# Altium project QUTMS-AMU-V1.PrjPcb
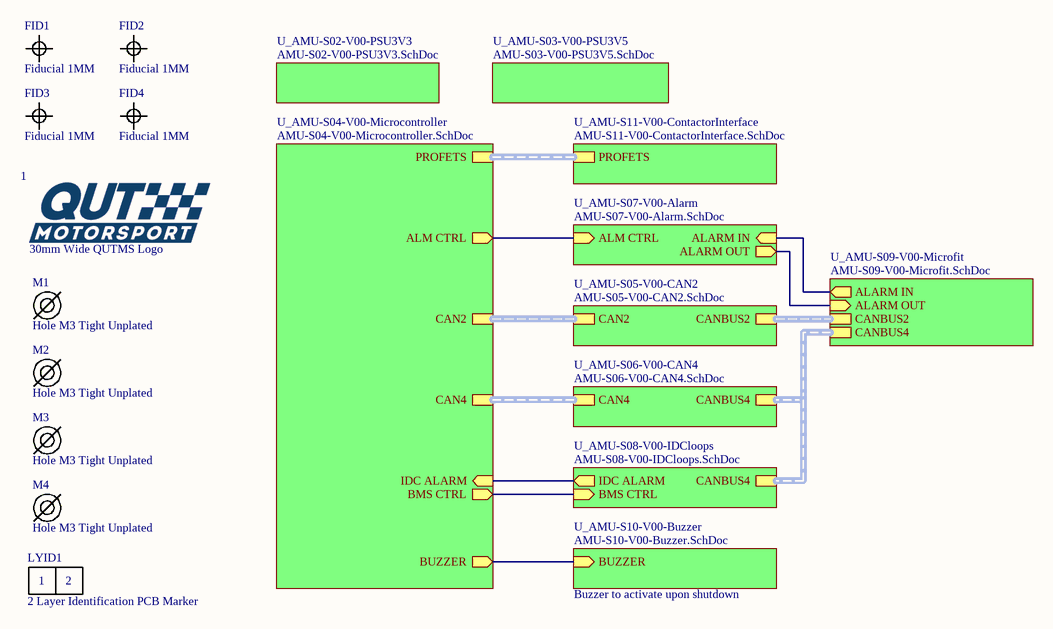
[diagram p0: AMU-S01-V00.SchDoc]
12 sheets, 174 parts. Net scope: hierarchical (ports join the sheet entries above them; power ports are global).
Board file: AMU-P01-V00.PcbDoc
Sheets:
  AMU-S01-V00.SchDoc
    U_AMU-S02-V00-PSU3V3 = AMU-S02-V00-PSU3V3.SchDoc
    U_AMU-S03-V00-PSU3V5 = AMU-S03-V00-PSU3V5.SchDoc
    U_AMU-S11-V00-ContactorInterface = AMU-S11-V00-ContactorInterface.SchDoc
      PROFET 3 = AMU-S12-V00-PROFET.SchDoc
      PROFET 2 = AMU-S12-V00-PROFET.SchDoc
      PROFET 1 = AMU-S12-V00-PROFET.SchDoc
    U_AMU-S04-V00-Microcontroller = AMU-S04-V00-Microcontroller.SchDoc
    U_AMU-S08-V00-IDCloops = AMU-S08-V00-IDCloops.SchDoc
    U_AMU-S07-V00-Alarm = AMU-S07-V00-Alarm.SchDoc
    U_AMU-S09-V00-Microfit = AMU-S09-V00-Microfit.SchDoc
    U_AMU-S10-V00-Buzzer = AMU-S10-V00-Buzzer.SchDoc
    U_AMU-S05-V00-CAN2 = AMU-S05-V00-CAN2.SchDoc
    U_AMU-S06-V00-CAN4 = AMU-S06-V00-CAN4.SchDoc

## Sheet AMU-S01-V00.SchDoc: AMU Master
size A3; DrawnBy: Thomas Benedetti; DocumentNumber: 1; SheetNumber: 1; SheetTotal: 12; Version: 00; Project: AMU 2020; PageSetup: Record=PageOptions|CenterHorizontal=True|CenterVertical=True|PrintScale=0.97|XCorrection=1.00|YCorrection=1.00|PrintKind=0|BorderSize=5000000|LeftOffset=0|BottomOffset=0|Orientation=2|PaperLength=1000|PaperWidth=1000|Scale=100|PaperSource=7|PrintQuality=-4|MediaType=1|DitherType=10|PaperKind=A4|PrintScaleMode=1

### Parts
1  30mm Wide QUTMS Logo  [QUTMS LOGO 30MM]
FID1  Fiducial 1MM  [FIDUCIAL 1MM]
FID2  Fiducial 1MM  [FIDUCIAL 1MM]
FID3  Fiducial 1MM  [FIDUCIAL 1MM]
FID4  Fiducial 1MM  [FIDUCIAL 1MM]
LYID1  2 Layer Identification PCB Marker  [LAYER IDENT 2]
M1  Hole M3 Tight Unplated  [M3.2 UNPLATED]
M2  Hole M3 Tight Unplated  [M3.2 UNPLATED]
M3  Hole M3 Tight Unplated  [M3.2 UNPLATED]
M4  Hole M3 Tight Unplated  [M3.2 UNPLATED]

### Sub-sheets
U_AMU-S02-V00-PSU3V3 = AMU-S02-V00-PSU3V3.SchDoc: no entries
U_AMU-S03-V00-PSU3V5 = AMU-S03-V00-PSU3V5.SchDoc: no entries
U_AMU-S04-V00-Microcontroller = AMU-S04-V00-Microcontroller.SchDoc: PROFETS, ALM CTRL (out), BMS CTRL (out), BUZZER (out), CAN2, CAN4, IDC ALARM (in)
U_AMU-S05-V00-CAN2 = AMU-S05-V00-CAN2.SchDoc: CANBUS2 (harness CANBUS2), CAN2 (harness CAN2)
U_AMU-S06-V00-CAN4 = AMU-S06-V00-CAN4.SchDoc: CANBUS4 (harness CANBUS4), CAN4 (harness CAN4)
U_AMU-S07-V00-Alarm = AMU-S07-V00-Alarm.SchDoc: ALARM IN (in), ALARM OUT (out), ALM CTRL (in)
U_AMU-S08-V00-IDCloops = AMU-S08-V00-IDCloops.SchDoc: BMS CTRL (in), CANBUS4 (harness CANBUS4), IDC ALARM (out)
U_AMU-S09-V00-Microfit = AMU-S09-V00-Microfit.SchDoc: CANBUS2 (harness CANBUS2), CANBUS4 (harness CANBUS4), ALARM OUT (in), ALARM IN (out)
U_AMU-S10-V00-Buzzer = AMU-S10-V00-Buzzer.SchDoc: BUZZER (in)
U_AMU-S11-V00-ContactorInterface = AMU-S11-V00-ContactorInterface.SchDoc: PROFETS (harness PROFETS)

### Nets
ALARM IN: sheet U_AMU-S07-V00-Alarm/ALARM IN, sheet U_AMU-S09-V00-Microfit/ALARM IN
ALARM OUT: sheet U_AMU-S07-V00-Alarm/ALARM OUT, sheet U_AMU-S09-V00-Microfit/ALARM OUT
ALM CTRL: sheet U_AMU-S04-V00-Microcontroller/ALM CTRL, sheet U_AMU-S07-V00-Alarm/ALM CTRL
BMS CTRL: sheet U_AMU-S04-V00-Microcontroller/BMS CTRL, sheet U_AMU-S08-V00-IDCloops/BMS CTRL
BUZZER: sheet U_AMU-S04-V00-Microcontroller/BUZZER, sheet U_AMU-S10-V00-Buzzer/BUZZER
IDC ALARM: sheet U_AMU-S04-V00-Microcontroller/IDC ALARM, sheet U_AMU-S08-V00-IDCloops/IDC ALARM

### Buses and harness runs
harness sheet U_AMU-S04-V00-Microcontroller/CAN2 = sheet U_AMU-S05-V00-CAN2/CAN2
harness sheet U_AMU-S04-V00-Microcontroller/CAN4 = sheet U_AMU-S06-V00-CAN4/CAN4
harness sheet U_AMU-S04-V00-Microcontroller/PROFETS = sheet U_AMU-S11-V00-ContactorInterface/PROFETS
harness sheet U_AMU-S05-V00-CAN2/CANBUS2 = sheet U_AMU-S09-V00-Microfit/CANBUS2
harness sheet U_AMU-S06-V00-CAN4/CANBUS4 = sheet U_AMU-S08-V00-IDCloops/CANBUS4 = sheet U_AMU-S09-V00-Microfit/CANBUS4

### Notes on the sheet
- Buzzer to activate upon shutdown
- Revision History:
- Sheet Title:
- Rev
- Date
- Description
- Project:
- Size:
- Drawn By:
- A3
- Number:
- Revision:
- Sheet
- Version:
- of
- QUT Motorsport
- O-120, Gardens Point
- 2 George Street
- Brisbane, QLD 4000
- Australia
- Print Date:
- Print Time:
- File Name:
- (in symbol Layer Identification 2) 1; 2

### Library data of the parts
1 = QUTMS Logo 30mm
LYID1 = Layer Identification 2
M1-M4 = Hole M3 Tight Unplated: M3.2 Hole, No Plating

## Sheet AMU-S02-V00-PSU3V3.SchDoc: Power Supply (20-40V to 3v3 @ 0.1-0.6A)
size A3; DrawnBy: Jonn Dillon; DocumentNumber: 2; Revision: 01; SheetNumber: 2; SheetTotal: 12; Version: 01; Project: AMU 2020 (Sourced from BMS 2020); PageSetup: Record=PageOptions|CenterHorizontal=True|CenterVertical=True|PrintScale=0.97|XCorrection=1.00|YCorrection=1.00|PrintKind=0|BorderSize=5000000|LeftOffset=0|BottomOffset=0|Orientation=2|PaperLength=1000|PaperWidth=1000|Scale=100|PaperSource=7|PrintQuality=-4|MediaType=1|DitherType=10|PaperKind=A4|PrintScaleMode=1
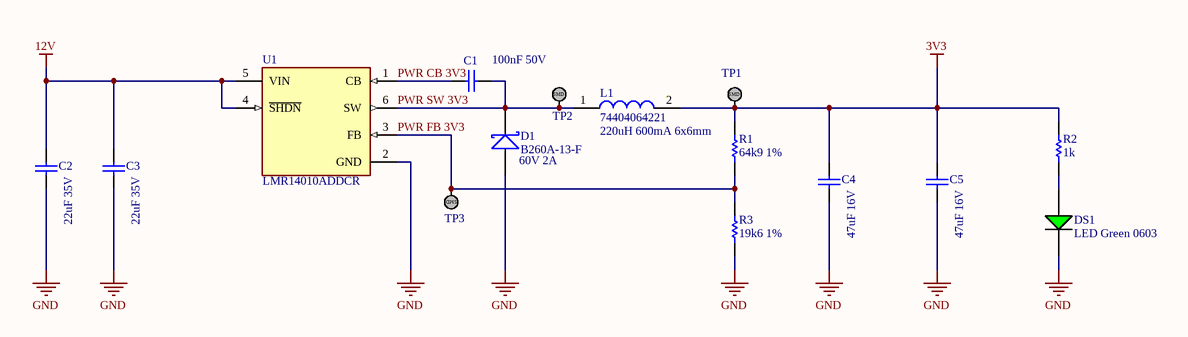
[diagram p1: AMU-S02-V00-PSU3V3.SchDoc]

### Parts
C1  100nF 50V  [Cap_Ceramic_0603]
C2  22uF 35V  [Cap_Ceramic_1206]
C3  22uF 35V  [Cap_Ceramic_1206]
C4  47uF 16V  [Cap_Ceramic_0603]
C5  47uF 16V  [Cap_Ceramic_0603]
D1  B260A-13-F  [SMA]
DS1  LED Green 0603  [LED GREEN 0603]
L1  74404064221  [Inductor_6x6mm]
R1  64k9 1%  [Res_ThinFilm_0603]
R2  1k  [Res_ThinFilm_0603]
R3  19k6 1%  [Res_ThinFilm_0603]
TP1  TestPoint_SMD  [TestPointSMD]  (value not drawn)
TP2  TestPoint_SMD  [TestPointSMD]  (value not drawn)
TP3  TestPoint_SMD  [TestPointSMD]  (value not drawn)
U1  LMR14010ADDCR  [FP-DDC0006A-MFG]

### Nets
3V3: C4.2 C5.2 L1.2 R1.2 R2.2 TP1.1
12V: C2.2 C3.2 U1.4(~{SHDN}) U1.5(VIN)
GND: C2.1 C3.1 C4.1 C5.1 D1.A DS1.2(C) R3.1 U1.2(GND)
PWR CB 3V3: C1.1 U1.1(CB)
PWR FB 3V3: R1.1 R3.2 TP3.1 U1.3(FB)
PWR SW 3V3: C1.2 D1.K L1.1 TP2.1 U1.6(SW)
NetDS1_1: DS1.1(A) R2.1

### Notes on the sheet
- (near D1) 60V 2A
- (near L1) 220uH 600mA 6x6mm
- Revision History:
- Sheet Title:
- Rev
- Date
- Description
- Project:
- Size:
- Drawn By:
- A3
- Number:
- Revision:
- Sheet
- Version:
- of
- QUT Motorsport
- O-120, Gardens Point
- 2 George Street
- Brisbane, QLD 4000
- Australia
- Print Date:
- Print Time:
- File Name:
- (in symbol TestPoint_SMD) SMD

### Library data of the parts
C1 = 100nF 50V 5% X7R 0603: Capacitor, Ceramic, SMD, 100nF, 50V, 5%, X7R, 0603
C2 C3 = 22uF 35V 20% X5R 1206: 22µF ±20% 35V Ceramic Capacitor X5R 1206 (3216 Metric); ComponentLink1Description: Digikey; ComponentLink1URL: https://www.digikey.com.au/product-detail/en/tdk-corporation/C3216X5R1V226M160AC/445-8045-1-ND/2792165; ComponentLink2Description: Datasheet; ComponentLink2URL: https://product.tdk.com/info/en/catalog/datasheets/mlcc_commercial_general_en.pdf
C4 C5 = 47uF 16V 10% X7R 1210: Capacitor, Ceramic, SMD, 47uF, 16V, 5%, X7R, 1210
D1 = B260A-13-F: Diode, Schottky Barrier Rectifier, 60 V, 2 A, B260A-13-F
L1 = 74404064221: FIXED IND 220UH 660MA 850 MOHM; ComponentLink1Description: Digikey; ComponentLink1URL: https://www.digikey.com.au/product-detail/en/w%C3%BCrth-elektronik/74404064221/732-7261-1-ND/5353241; ComponentLink2Description: LCSC A; ComponentLink2URL: https://lcsc.com/product-detail/Power-Inductors_Sunlord-SWPA6045S221MT_C91047.html; ComponentLink3Description: LCSC B; ComponentLink3URL: https://lcsc.com/product-detail/Power-Inductors_SXN-Shun-Xiang-Nuo-Elec-SMNR6045-221MT_C467145.html
R1 = 64k9 1% 0603: Resistor, SMD, 64k9, 0.1W, 5%, 0603
R2 = 1k 5% 0603: Resistor, SMD, 1k, 0.1W, 5%, 0603
R3 = 19k6 1% 0603: Resistor, SMD, 19k6, 0.1W, 5%, 0603
U1 = CMP-04918-000056-1: IC REG BUCK ADJ 1A TSOT23-6; Manufacturer: Texas Instruments; Max Junction Temp: +125°C; Number Of Outputs: 1; Standoff Height: 0mm; Switching Frequency: 700kHz; Min Supply Voltage: 4V; Max Supply Voltage: 40V; Max Duty Cycle: 96%; Output Type: AdjustableProgrammable; Manufacturer Part Number: LMR14010ADDCR; Temperature: -40°C to +125°C; Output Current: 1A; Category: IC; Temperature Range High: +125°C; Lead Free: Yes; Switching Topology: Buck; Mouser Description: 4-V to 40-V, 1-A Step-Down Converter With High Efficiency Eco-Mode 6-SOT-23-THIN -40 to 125; Device Class L1: Integrated Circuits (ICs); Digikey Description: IC REG BUCK ADJ 1A TSOT23-6; Package: DDC0006A; Ipc Land Pattern Name: SOT95P280X110-6; Device Class L2: Power Management ICs; Temperature Range Low: -40°C; Height: 1.1mm; Device Class L3: Voltage Regulators - Switching; RoHS: TRUE; Automotive: No; Octopart: https://octopart.com/lmr14010addcr-texas+instruments-90753290; ComponentLink2URL: https://www.ti.com/lit/ds/symlink/lmr14010a.pdf; ComponentLink2Description: Datasheet

## Sheet AMU-S03-V00-PSU3V5.SchDoc: Power Supply (20-40V to 3v3 @ 0.1-0.6A)
size A3; DrawnBy: Jonn Dillon; DocumentNumber: 3; SheetNumber: 3; SheetTotal: 12; Version: 00; Project: AMU 2020 (Sourced from BMS 2020); PageSetup: Record=PageOptions|CenterHorizontal=True|CenterVertical=True|PrintScale=0.97|XCorrection=1.00|YCorrection=1.00|PrintKind=0|BorderSize=5000000|LeftOffset=0|BottomOffset=0|Orientation=2|PaperLength=1000|PaperWidth=1000|Scale=100|PaperSource=7|PrintQuality=-4|MediaType=1|DitherType=10|PaperKind=A4|PrintScaleMode=1
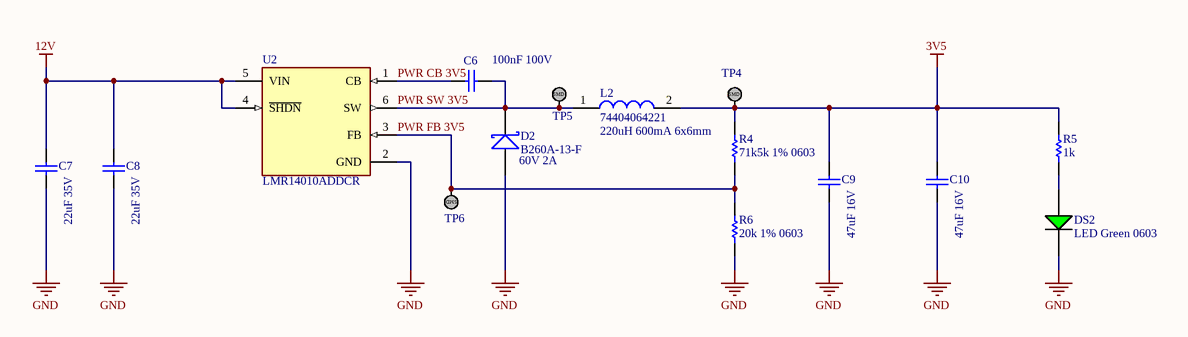
[diagram p2: AMU-S03-V00-PSU3V5.SchDoc]

### Parts
C6  100nF 100V  [Cap_Ceramic_0603]
C7  22uF 35V  [Cap_Ceramic_1206]
C8  22uF 35V  [Cap_Ceramic_1206]
C9  47uF 16V  [Cap_Ceramic_0603]
C10  47uF 16V  [Cap_Ceramic_0603]
D2  B260A-13-F  [SMA]
DS2  LED Green 0603  [LED GREEN 0603]
L2  74404064221  [Inductor_6x6mm]
R4  71k5k 1% 0603  [Res_ThinFilm_0603]
R5  1k  [Res_ThinFilm_0603]
R6  20k 1% 0603  [Res_ThinFilm_0603]
TP4  TestPoint_SMD  [TestPointSMD]  (value not drawn)
TP5  TestPoint_SMD  [TestPointSMD]  (value not drawn)
TP6  TestPoint_SMD  [TestPointSMD]  (value not drawn)
U2  LMR14010ADDCR  [FP-DDC0006A-MFG]

### Nets
3V5: C9.2 C10.2 L2.2 R4.2 R5.2 TP4.1
12V: C7.2 C8.2 U2.4(~{SHDN}) U2.5(VIN)
GND: C7.1 C8.1 C9.1 C10.1 D2.A DS2.2(C) R6.1 U2.2(GND)
PWR CB 3V5: C6.1 U2.1(CB)
PWR FB 3V5: R4.1 R6.2 TP6.1 U2.3(FB)
PWR SW 3V5: C6.2 D2.K L2.1 TP5.1 U2.6(SW)
NetDS2_1: DS2.1(A) R5.1

### Notes on the sheet
- (near D2) 60V 2A
- (near L2) 220uH 600mA 6x6mm
- Revision History:
- Sheet Title:
- Rev
- Date
- Description
- Project:
- Size:
- Drawn By:
- A3
- Number:
- Revision:
- Sheet
- Version:
- of
- QUT Motorsport
- O-120, Gardens Point
- 2 George Street
- Brisbane, QLD 4000
- Australia
- Print Date:
- Print Time:
- File Name:
- (in symbol TestPoint_SMD) SMD

### Library data of the parts
C6 = 100nF 100V 5% X7R 0603: Capacitor, Ceramic, SMD, 100nF, 100V, 5%, X7R, 0603
C7 C8 = 22uF 35V 20% X5R 1206: as C2 on sheet AMU-S02-V00-PSU3V3; ComponentLink1Description: Digikey; ComponentLink1URL: https://www.digikey.com.au/product-detail/en/tdk-corporation/C3216X5R1V226M160AC/445-8045-1-ND/2792165; ComponentLink2Description: Datasheet; ComponentLink2URL: https://product.tdk.com/info/en/catalog/datasheets/mlcc_commercial_general_en.pdf
C9 C10 = 47uF 16V 10% X7R 1210: as C4 on sheet AMU-S02-V00-PSU3V3
D2 = B260A-13-F: as D1 on sheet AMU-S02-V00-PSU3V3
L2 = 74404064221: FIXED IND 220UH 660MA 850 MOHM; ComponentLink1Description: Digikey; ComponentLink1URL: https://www.digikey.com.au/product-detail/en/w%C3%BCrth-elektronik/74404064221/732-7261-1-ND/5353241; ComponentLink2Description: LCSC A; ComponentLink2URL: https://lcsc.com/product-detail/Power-Inductors_Sunlord-SWPA6045S221MT_C91047.html; ComponentLink3Description: LCSC B; ComponentLink3URL: https://lcsc.com/product-detail/Power-Inductors_SXN-Shun-Xiang-Nuo-Elec-SMNR6045-221MT_C467145.html
R4 = 71k5 1% 0603: Resistor, SMD, 71k5, 0.1W, 1%, 0603
R5 = 1k 5% 0603: Resistor, SMD, 1k, 0.1W, 5%, 0603
R6 = 20k 1% 0603: Resistor, SMD, 20k, 0.1W, 1%, 0603
U2 = CMP-04918-000056-1: as U1 on sheet AMU-S02-V00-PSU3V3; Manufacturer Part Number: LMR14010ADDCR; Temperature: -40°C to +125°C; Output Current: 1A; Category: IC; Temperature Range High: +125°C; Lead Free: Yes; Switching Topology: Buck; Mouser Description: 4-V to 40-V, 1-A Step-Down Converter With High Efficiency Eco-Mode 6-SOT-23-THIN -40 to 125; Device Class L1: Integrated Circuits (ICs); Digikey Description: IC REG BUCK ADJ 1A TSOT23-6; Package: DDC0006A; Ipc Land Pattern Name: SOT95P280X110-6; Device Class L2: Power Management ICs; Temperature Range Low: -40°C; Height: 1.1mm; Device Class L3: Voltage Regulators - Switching; RoHS: TRUE; Automotive: No; Octopart: https://octopart.com/lmr14010addcr-texas+instruments-90753290; ComponentLink2URL: https://www.ti.com/lit/ds/symlink/lmr14010a.pdf; ComponentLink2Description: Datasheet

## Sheet AMU-S11-V00-ContactorInterface.SchDoc: Contactor Interface
size A3; DrawnBy: Thomas Benedetti; DocumentNumber: 11; SheetNumber: 11; SheetTotal: 12; Version: 00; Project: AMU 2020; PageSetup: Record=PageOptions|CenterHorizontal=True|CenterVertical=True|PrintScale=0.97|XCorrection=1.00|YCorrection=1.00|PrintKind=0|BorderSize=5000000|LeftOffset=0|BottomOffset=0|Orientation=2|PaperLength=1000|PaperWidth=1000|Scale=100|PaperSource=7|PrintQuality=-4|MediaType=1|DitherType=10|PaperKind=A4|PrintScaleMode=1
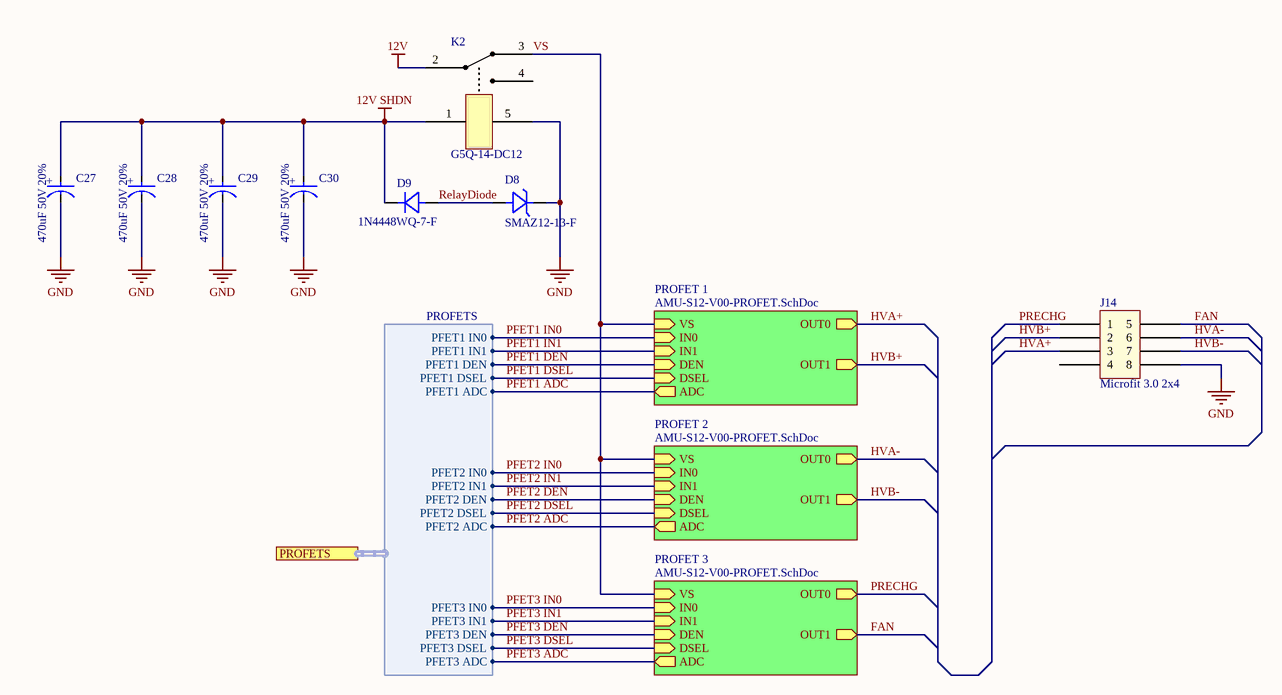
[diagram p3: AMU-S11-V00-ContactorInterface.SchDoc]

### Parts
C27  470uF 50V 20%  [CAP_ALU_TH]
C28  470uF 50V 20%  [CAP_ALU_TH]
C29  470uF 50V 20%  [CAP_ALU_TH]
C30  470uF 50V 20%  [CAP_ALU_TH]
D8  SMAZ12-13-F  [SMA]
D9  1N4448WQ-7-F  [SMA]
J14  Microfit 3.0 2x4  [Microfit_2X4_R_TH]
K2  G5Q-14-DC12  [G5Q-14]

### Sub-sheets
PROFET 1 = AMU-S12-V00-PROFET.SchDoc: VS (in), ADC (out), OUT0 (out), OUT1 (out), DSEL (in), DEN (in), IN1 (in), IN0 (in)
PROFET 2 = AMU-S12-V00-PROFET.SchDoc: VS (in), ADC (out), OUT0 (out), OUT1 (out), DSEL (in), DEN (in), IN1 (in), IN0 (in)
PROFET 3 = AMU-S12-V00-PROFET.SchDoc: VS (in), ADC (out), OUT0 (out), OUT1 (out), DSEL (in), DEN (in), IN1 (in), IN0 (in)

### Ports
PROFETS (harness PROFETS)

### Harnesses
PROFETS: PFET1 IN0, PFET1 IN1, PFET1 DEN, PFET1 DSEL, PFET1 ADC, PFET2 IN0, PFET2 IN1, PFET2 DEN, PFET2 DSEL, PFET2 ADC, PFET3 IN0, PFET3 DSEL, PFET3 ADC, PFET3 DEN, PFET3 IN1

### Nets
12V: K2.2
12V SHDN: C27.A C28.A C29.A C30.A D9.K(Cathode) K2.1
GND: C27.K C28.K C29.K C30.K D8.K(Cathode) J14.8 K2.5
FAN: J14.5 ; sheet PROFET 3/OUT1
HVA+: J14.3 ; sheet PROFET 1/OUT0
HVA-: J14.6 ; sheet PROFET 2/OUT0
HVB+: J14.2 ; sheet PROFET 1/OUT1
HVB-: J14.7 ; sheet PROFET 2/OUT1
PFET1 ADC: sheet PROFET 1/ADC, port PROFETS.PFET1 ADC
PFET1 DEN: sheet PROFET 1/DEN, port PROFETS.PFET1 DEN
PFET1 DSEL: sheet PROFET 1/DSEL, port PROFETS.PFET1 DSEL
PFET1 IN0: sheet PROFET 1/IN0, port PROFETS.PFET1 IN0
PFET1 IN1: sheet PROFET 1/IN1, port PROFETS.PFET1 IN1
PFET2 ADC: sheet PROFET 2/ADC, port PROFETS.PFET2 ADC
PFET2 DEN: sheet PROFET 2/DEN, port PROFETS.PFET2 DEN
PFET2 DSEL: sheet PROFET 2/DSEL, port PROFETS.PFET2 DSEL
PFET2 IN0: sheet PROFET 2/IN0, port PROFETS.PFET2 IN0
PFET2 IN1: sheet PROFET 2/IN1, port PROFETS.PFET2 IN1
PFET3 ADC: sheet PROFET 3/ADC, port PROFETS.PFET3 ADC
PFET3 DEN: sheet PROFET 3/DEN, port PROFETS.PFET3 DEN
PFET3 DSEL: sheet PROFET 3/DSEL, port PROFETS.PFET3 DSEL
PFET3 IN0: sheet PROFET 3/IN0, port PROFETS.PFET3 IN0
PFET3 IN1: sheet PROFET 3/IN1, port PROFETS.PFET3 IN1
PRECHG: J14.1 ; sheet PROFET 3/OUT0  [project net OUT0]
RelayDiode: D8.A(Anode) D9.A(Anode)
VS: K2.3 ; sheet PROFET 3/VS, sheet PROFET 2/VS, sheet PROFET 1/VS

Not connected (* = marked no-connect by the designer): J14 4; K2 4

### Notes on the sheet
- Revision History:
- Sheet Title:
- Rev
- Date
- Description
- Project:
- Size:
- Drawn By:
- A3
- Number:
- Revision:
- Sheet
- Version:
- of
- QUT Motorsport
- O-120, Gardens Point
- 2 George Street
- Brisbane, QLD 4000
- Australia
- Print Date:
- Print Time:
- File Name:
- (in symbol 470uF 50V 20% Alum E-CAP) +

### Library data of the parts
C27-C30 = 470uF 50V 20% Alum E-CAP: 470µF 50V Aluminum Electrolytic Capacitors Radial, Can  5000 Hrs @ 105°C
D8 = SMAZ12-13-F: Zener Diode 12V 1W ±5% Surface Mount SMA; Manufacturer: ON Semiconductor; MPN: MM3Z56VB; ComponentLink1Description: Digikey; ComponentLink1URL: https://www.digikey.com.au/product-detail/en/diodes-incorporated/SMAZ12-13-F/SMAZ12-FDICT-ND/725073; ComponentLink2Description: Datasheet; ComponentLink2URL: https://www.diodes.com/assets/Datasheets/ds18015.pdf
D9 = 1N4448WQ-7-F: Diode, SMD, 75V, 5%, 250mA, SOD123; Manufacturer: ON Semiconductor / Fairchild; Manufacturer Part Number: 1N914BWS; Average Rectified Current: 150mA; Element Configuration: Single; Forward Voltage: 1V; Max Reverse Leakage Current: 5uA; Power Dissipation: 200mW; Recovery Time: 4ns; Max Forward Surge Current (Ifsm): 4A; Parameter 1: *; Weight: 0.0276g; Category: Rectifier Diodes; Contact Plating: Tin,Matte; Forward Current: 150mA; Lead Free: Lead Free; Max Operating Temperature: 150°C; Max Repetitive Reverse Voltage (Vrrm): 75V; Max Reverse Voltage (DC): 75V; Min Operating Temperature: -55°C; Mount: Surface Mount; Number of Pins: 2; Package Quantity: 1; Packaging: Tape and Reel; Peak Reverse Current: 5uA; Radiation Hardening: No; REACH SVHC: No SVHC; Reverse Recovery Time: 4ns; Height: 1mm; Length: 1.8mm; Reverse Voltage: 75V; Width: 1.35mm
J14 = Microfit_2x4
K2 = G5Q-14-DC12: General Purpose Relay SPDT (1 Form C) 12VDC Coil Through Hole, 12V, 16A

## Sheet AMU-S12-V00-PROFET.SchDoc
size A3; DocumentNumber: 12; SheetNumber: 12; SheetTotal: 12; Version: 00; Project: ####; PageSetup: Record=PageOptions|CenterHorizontal=True|CenterVertical=True|PrintScale=0.97|XCorrection=1.00|YCorrection=1.00|PrintKind=0|BorderSize=5000000|LeftOffset=0|BottomOffset=0|Orientation=2|PaperLength=1000|PaperWidth=1000|Scale=100|PaperSource=7|PrintQuality=-4|MediaType=1|DitherType=10|PaperKind=A4|PrintScaleMode=1
Used 3 times, as channels U_AMU-S11-V00-ContactorInterface/PROFET 3, U_AMU-S11-V00-ContactorInterface/PROFET 2, U_AMU-S11-V00-ContactorInterface/PROFET 1. Parts and nets are listed once, with the designators drawn on the sheet.
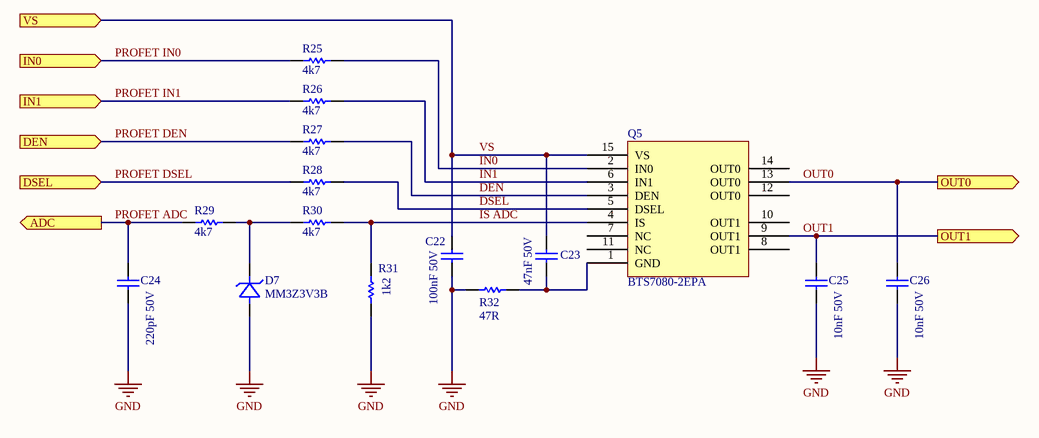
[diagram p4: AMU-S12-V00-PROFET.SchDoc]

### Parts
C22  100nF 50V  [Cap_Ceramic_0603]
C23  47nF 50V  [Cap_Ceramic_0603]
C24  220pF 50V  [Cap_Ceramic_0603]
C25  10nF 50V  [Cap_Ceramic_0603]
C26  10nF 50V  [Cap_Ceramic_0603]
D7  MM3Z3V3B  [SOD-323F]
Q5  BTS7080-2EPA  [BTS7008-2EPZ]
R25  4k7  [Res_ThinFilm_0603]
R26  4k7  [Res_ThinFilm_0603]
R27  4k7  [Res_ThinFilm_0603]
R28  4k7  [Res_ThinFilm_0603]
R29  4k7  [Res_ThinFilm_0603]
R30  4k7  [Res_ThinFilm_0603]
R31  1k2  [Res_ThinFilm_0603]
R32  47R  [Res_ThinFilm_0603]

### Ports
ADC (out), DEN (in), DSEL (in), IN0 (in), IN1 (in), OUT0 (out), OUT1 (out), VS (in)

### Nets
GND: C22.1 C24.1 C25.2 C26.2 D7.1(Anode) R31.1 R32.1
DEN: Q5.3(DEN) R27.2
DSEL: Q5.5(DSEL) R28.2
IN0: Q5.2(IN0) R25.2
IN1: Q5.6(IN1) R26.2
IS ADC: Q5.4(IS) R30.2 R31.2
OUT0: C26.1 Q5.13(OUT0) ; port OUT0
OUT1: C25.1 Q5.9(OUT1) ; port OUT1
PROFET ADC: C24.2 R29.1 ; port ADC
PROFET DEN: R27.1 ; port DEN
PROFET DSEL: R28.1 ; port DSEL
PROFET IN0: R25.1 ; port IN0
PROFET IN1: R26.1 ; port IN1
VS: C22.2 C23.2 Q5.15(VS) ; port VS
NetC23_1: C23.1 Q5.1(GND) R32.2
NetD7_2: D7.2(Cathode) R29.2 R30.1

Not connected (* = marked no-connect by the designer): Q5 7(NC) 8(OUT1) 10(OUT1) 11(NC) 12(OUT0) 14(OUT0)

### Channels
U_AMU-S11-V00-ContactorInterface/PROFET 3: designators end in A; ports ADC=PFET3 ADC DEN=PFET3 DEN DSEL=PFET3 DSEL IN0=PFET3 IN0 IN1=PFET3 IN1 OUT0=OUT0 OUT1=FAN VS=VS
U_AMU-S11-V00-ContactorInterface/PROFET 2: designators end in B; ports ADC=PFET2 ADC DEN=PFET2 DEN DSEL=PFET2 DSEL IN0=PFET2 IN0 IN1=PFET2 IN1 OUT0=HVA- OUT1=HVB- VS=VS
U_AMU-S11-V00-ContactorInterface/PROFET 1: designators end in C; ports ADC=PFET1 ADC DEN=PFET1 DEN DSEL=PFET1 DSEL IN0=PFET1 IN0 IN1=PFET1 IN1 OUT0=HVA+ OUT1=HVB+ VS=VS

### Notes on the sheet
- Revision History:
- Sheet Title:
- Rev
- Date
- Description
- Project:
- Size:
- Drawn By:
- A3
- Number:
- Revision:
- Sheet
- Version:
- of
- QUT Motorsport
- O-120, Gardens Point
- 2 George Street
- Brisbane, QLD 4000
- Australia
- Print Date:
- Print Time:
- File Name:

### Library data of the parts
C22 = 100nF 50V 5% X7R 0603: as C1 on sheet AMU-S02-V00-PSU3V3
C23 = 47nF 50V 10% X7R 0603: 0.047µF ±10% 50V Ceramic Capacitor X7R 0603 (1608 Metric); ComponentLink1Description: Digikey; ComponentLink1URL: https://www.digikey.com.au/product-detail/en/kemet/C0603C473K5RACTU/399-7933-1-ND/3471656; ComponentLink2Description: Datasheet; ComponentLink2URL: https://content.kemet.com/datasheets/KEM_C1002_X7R_SMD.pdf
C24 = 220pF 50V 5% 0603: 220pF ±5% 50V Ceramic Capacitor C0G, NP0 0603 (1608 Metric); ComponentLink1Description: Digikey; ComponentLink1URL: https://www.digikey.com.au/product-detail/en/kemet/C0603C221J5GACTU/399-1066-1-ND/411341; ComponentLink2Description: Datasheet; ComponentLink2URL: https://content.kemet.com/datasheets/KEM_C1003_C0G_SMD.pdf
C25 C26 = 10nF 50V 20% X7R 0603: 10000pF ±20% 50V Ceramic Capacitor X7R 0603 (1608 Metric); ComponentLink1Description: Digikey; ComponentLink1URL: https://www.digikey.com.au/product-detail/en/kemet/C0603C103M5RACTU/399-7842-1-ND/3471565; ComponentLink2Description: Datasheet; ComponentLink2URL: https://content.kemet.com/datasheets/KEM_C1002_X7R_SMD.pdf
D7 = MM3Z3V3B: Zener Diode 3.3V 200mW ±2% Surface Mount SOD-323F; Manufacturer: ON Semiconductor; MPN: MM3Z56VB; ComponentLink1Description: Digikey; ComponentLink1URL: https://www.digikey.com.au/product-detail/en/on-semiconductor/MM3Z3V3B/MM3Z3V3BCT-ND/1626881; ComponentLink2Description: Datasheet; ComponentLink2URL: https://www.onsemi.com/pub/Collateral/MM3Z9V1B-D.pdf
R25-R30 = 4k7 5% 0603: Resistor, SMD, 4k7, 0.1W, 5%, 0603
R31 = 1k2 5% 0603: Resistor, SMD, 1k2, 0.1W, 5%, 0603
R32 = 47R 5% 0603: Resistor, SMD, 47R, 0.1W, 5%, 0603
Q5 = BTS7080-2EPA: ComponentLink1Description: Infineon; ComponentLink1URL: https://www.infineon.com/cms/en/product/power/smart-low-side-high-side-switches/high-side-switches/profet-plus-2-12v-automotive-smart-high-side-switch/bts7080-2epa/; ComponentLink2Description: Datasheet; ComponentLink2URL: https://www.infineon.com/dgdl/Infineon-BTS7080-2EPA-DataSheet-v01_06-EN.pdf?fileId=5546d4625e763904015e941bf21e2dbe

## Sheet AMU-S04-V00-Microcontroller.SchDoc: AMU Microcontroller
size A3; DrawnBy: Thomas Benedetti; DocumentNumber: 4; Revision: 01; SheetNumber: 4; SheetTotal: 12; Version: 01; Project: AMU 2020; PageSetup: Record=PageOptions|CenterHorizontal=True|CenterVertical=True|PrintScale=0.97|XCorrection=1.00|YCorrection=1.00|PrintKind=0|BorderSize=5000000|LeftOffset=0|BottomOffset=0|Orientation=2|PaperLength=1000|PaperWidth=1000|Scale=100|PaperSource=7|PrintQuality=-4|MediaType=1|DitherType=10|PaperKind=A4|PrintScaleMode=1
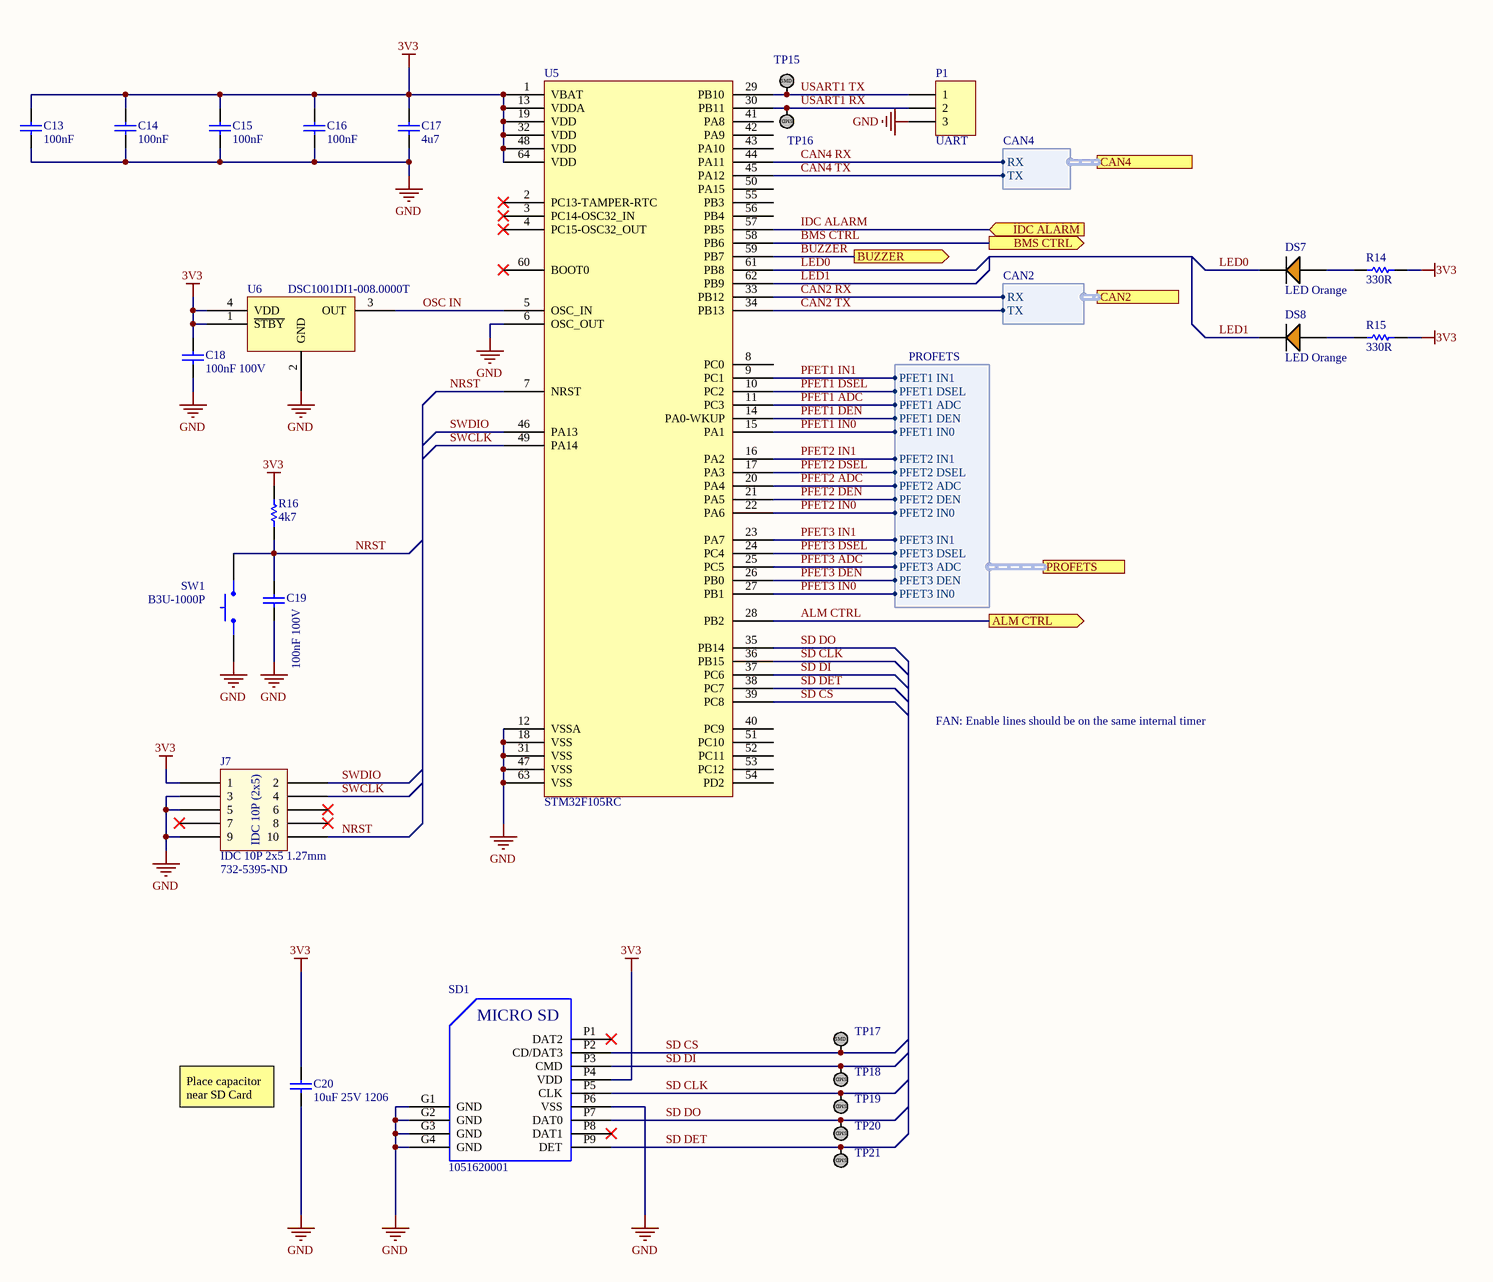
[diagram p5: AMU-S04-V00-Microcontroller.SchDoc]

### Parts
C13  100nF  [Cap_Ceramic_0603]
C14  100nF  [Cap_Ceramic_0603]
C15  100nF  [Cap_Ceramic_0603]
C16  100nF  [Cap_Ceramic_0603]
C17  4u7  [Cap_Ceramic_0603]
C18  100nF 100V  [Cap_Ceramic_0603]
C19  100nF 100V  [Cap_Ceramic_0603]
C20  10uF 25V 1206  [Cap_Ceramic_1206]
DS7  LED Orange  [LED ORANGE 0603]
DS8  LED Orange  [LED ORANGE 0603]
J7  IDC 10P 2x5 1.27mm  [IDC 1.27MM 10P]
P1  UART  [HDR1X3]
R14  330R  [Res_ThinFilm_0603]
R15  330R  [Res_ThinFilm_0603]
R16  4k7  [Res_ThinFilm_0603]
SD1  1051620001  [1051620001]
SW1  B3U-1000P  [BTN B3U-1000P]
TP15  TestPoint_SMD  [TestPointSMD]  (value not drawn)
TP16  TestPoint_SMD  [TestPointSMD]  (value not drawn)
TP17  TestPoint_SMD  [TestPointSMD]  (value not drawn)
TP18  TestPoint_SMD  [TestPointSMD]  (value not drawn)
TP19  TestPoint_SMD  [TestPointSMD]  (value not drawn)
TP20  TestPoint_SMD  [TestPointSMD]  (value not drawn)
TP21  TestPoint_SMD  [TestPointSMD]  (value not drawn)
U5  STM32F105RC  [STM32F105RC]
U6  DSC1001DI1-008.0000T  [DSC1001DI1-008.0000TCT-ND]

### Ports
ALM CTRL (out), BMS CTRL (out), BUZZER (out), CAN2 (harness CAN2), CAN4 (harness CAN4), IDC ALARM (in), PROFETS (harness PROFETS)

### Harnesses
PROFETS: PFET3 IN0, PFET3 DEN, PFET3 ADC, PFET3 DSEL, PFET3 IN1, PFET2 DEN, PFET2 DSEL, PFET2 ADC, PFET2 IN0, PFET2 IN1, PFET1 IN1, PFET1 DEN, PFET1 IN0, PFET1 ADC, PFET1 DSEL
CAN2: TX, RX
CAN4: RX, TX

### Nets
3V3: C13.2 C14.2 C15.2 C16.2 C17.2 C18.2 C20.2 J7.1 R14.2 R15.2 R16.2 SD1.P4(VDD) U5.1(VBAT) U5.13(VDDA) U5.19(VDD) U5.32(VDD) U5.48(VDD) U5.64(VDD) U6.1(~{STBY}) U6.4(VDD)
GND: C13.1 C14.1 C15.1 C16.1 C17.1 C18.1 C19.1 C20.1 J7.3 J7.5 J7.9 P1.3 SD1.G1(GND) SD1.G2(GND) SD1.G3(GND) SD1.G4(GND) SD1.P6(VSS) SW1.1 U5.6(OSC_OUT) U5.12(VSSA) U5.18(VSS) U5.31(VSS) U5.47(VSS) U5.63(VSS) U6.2(GND)
ALM CTRL: U5.28(PB2) ; port ALM CTRL
BMS CTRL: U5.58(PB6) ; port BMS CTRL
BUZZER: U5.59(PB7) ; port BUZZER
CAN2 RX: U5.33(PB12) ; port CAN2.RX
CAN2 TX: U5.34(PB13) ; port CAN2.TX
CAN4 RX: U5.44(PA11) ; port CAN4.RX
CAN4 TX: U5.45(PA12) ; port CAN4.TX
IDC ALARM: U5.57(PB5) ; port IDC ALARM
LED0: DS7.2(C) U5.61(PB8)
LED1: DS8.2(C) U5.62(PB9)
NRST: C19.2 J7.10 R16.1 SW1.2 U5.7(NRST)
OSC IN: U5.5(OSC_IN) U6.3(OUT)
PFET1 ADC: U5.11(PC3) ; port PROFETS.PFET1 ADC
PFET1 DEN: U5.14(PA0-WKUP) ; port PROFETS.PFET1 DEN
PFET1 DSEL: U5.10(PC2) ; port PROFETS.PFET1 DSEL
PFET1 IN0: U5.15(PA1) ; port PROFETS.PFET1 IN0
PFET1 IN1: U5.9(PC1) ; port PROFETS.PFET1 IN1
PFET2 ADC: U5.20(PA4) ; port PROFETS.PFET2 ADC
PFET2 DEN: U5.21(PA5) ; port PROFETS.PFET2 DEN
PFET2 DSEL: U5.17(PA3) ; port PROFETS.PFET2 DSEL
PFET2 IN0: U5.22(PA6) ; port PROFETS.PFET2 IN0
PFET2 IN1: U5.16(PA2) ; port PROFETS.PFET2 IN1
PFET3 ADC: U5.25(PC5) ; port PROFETS.PFET3 ADC
PFET3 DEN: U5.26(PB0) ; port PROFETS.PFET3 DEN
PFET3 DSEL: U5.24(PC4) ; port PROFETS.PFET3 DSEL
PFET3 IN0: U5.27(PB1) ; port PROFETS.PFET3 IN0
PFET3 IN1: U5.23(PA7) ; port PROFETS.PFET3 IN1
SD CLK: SD1.P5(CLK) TP19.1 U5.36(PB15)
SD CS: SD1.P2(CD/DAT3) TP17.1 U5.39(PC8)
SD DET: SD1.P9(DET) TP21.1 U5.38(PC7)
SD DI: SD1.P3(CMD) TP18.1 U5.37(PC6)
SD DO: SD1.P7(DAT0) TP20.1 U5.35(PB14)
SWCLK: J7.4 U5.49(PA14)
SWDIO: J7.2 U5.46(PA13)
USART1 RX: P1.2 TP16.1 U5.30(PB11)
USART1 TX: P1.1 TP15.1 U5.29(PB10)
NetDS7_1: DS7.1(A) R14.1
NetDS8_1: DS8.1(A) R15.1

Not connected (* = marked no-connect by the designer): J7 6* 7* 8*; SD1 P1(DAT2)* P8(DAT1)*; U5 2(PC13-TAMPER-RTC)* 3(PC14-OSC32_IN)* 4(PC15-OSC32_OUT)* 8(PC0) 40(PC9) 41(PA8) 42(PA9) 43(PA10) 50(PA15) 51(PC10) 52(PC11) 53(PC12) 54(PD2) 55(PB3) 56(PB4) 60(BOOT0)*

### Notes on the sheet
- FAN: Enable lines should be on the same internal timer
- (near J7) 732-5395-ND
- (near C20) Place capacitor near SD Card
- Revision History:
- Sheet Title:
- Rev
- Date
- Description
- Project:
- Size:
- Drawn By:
- A3
- Number:
- Revision:
- Sheet
- Version:
- of
- QUT Motorsport
- O-120, Gardens Point
- 2 George Street
- Brisbane, QLD 4000
- Australia
- Print Date:
- Print Time:
- File Name:
- (in symbol 1051620001) MICRO SD
- (in symbol IDC 10P 2x5 1.27mm) IDC 10P (2x5)
- (in symbol TestPoint_SMD) SMD

### Library data of the parts
C13-C16 = 100nF 50V 5% X7R 0603: as C1 on sheet AMU-S02-V00-PSU3V3
C17 = 4u7 50V 5% X7R 0603: Capacitor, Ceramic, SMD, 4u7, 50V, 5%, X7R, 0603
C18 C19 = 100nF 100V 5% X7R 0603: as C6 on sheet AMU-S03-V00-PSU3V5
C20 = 10uF 25V 10% X7R 1206: Capacitor, Ceramic, SMD, 10uF, 25V, 10%, X7R, 1206
DS7 DS8 = LED ORANGE 0603
P1 = Header 3: Header, 3-Pin; LatestRevisionDate: 17-Jul-2002; LatestRevisionNote: Re-released for DXP Platform.; Publisher: Altium Limited
R14 R15 = 330R 5% 0603: Resistor, SMD, 330R, 0.1W, 5%, 0603
R16 = 4k7 5% 0603: Resistor, SMD, 4k7, 0.1W, 5%, 0603
SD1 = 1051620001: 9 (8 + 1) Position Card Connector microSD™ Surface Mount, Right Angle Gold; ComponentLink1Description: Digikey; ComponentLink1URL: https://www.digikey.com.au/product-detail/en/molex/1051620001/WM14405CT-ND/6133135; ComponentLink2Description: Datasheet; ComponentLink2URL: https://www.molex.com/pdm_docs/sd/1051620001_sd.pdf
SW1 = BTN B3U-1000P: Omron B3U-1000P Ultra Miniture Switch; ComponentLink1Description: LCSC; ComponentLink1URL: https://lcsc.com/product-detail/Tactile-Switches_BRIGHT-TSA063G50-250_C294565.html
U5 = STM32F105RC: ARM® Cortex®-M3 STM32F1 Microcontroller IC 32-Bit 72MHz 256KB (256K x 8) FLASH 64-LQFP (10x10); ComponentLink1Description: Digikey; ComponentLink1URL: https://www.digikey.com.au/product-detail/en/stmicroelectronics/STM32F105RCT6TR/497-17397-1-ND/8024118; ComponentLink2Description: Datasheet; ComponentLink2URL: https://www.st.com/content/ccc/resource/technical/document/datasheet/e4/f3/1a/89/5a/02/46/ae/CD00220364.pdf/files/CD00220364.pdf/jcr:content/translations/en.CD00220364.pdf
U6 = DSC1001DI1-008.0000T: on 8MHz XO (Standard) CMOS Oscillator 1.8 ~ 3.3V Standby (Power Down) 4-SMD, No Lead

## Sheet AMU-S08-V00-IDCloops.SchDoc: BMS Interface
size A3; DrawnBy: Thomas Benedetti; DocumentNumber: 8; SheetNumber: 8; SheetTotal: 12; Version: 00; Project: AMU 2020; PageSetup: Record=PageOptions|CenterHorizontal=True|CenterVertical=True|PrintScale=0.97|XCorrection=1.00|YCorrection=1.00|PrintKind=0|BorderSize=5000000|LeftOffset=0|BottomOffset=0|Orientation=2|PaperLength=1000|PaperWidth=1000|Scale=100|PaperSource=7|PrintQuality=-4|MediaType=1|DitherType=10|PaperKind=A4|PrintScaleMode=1
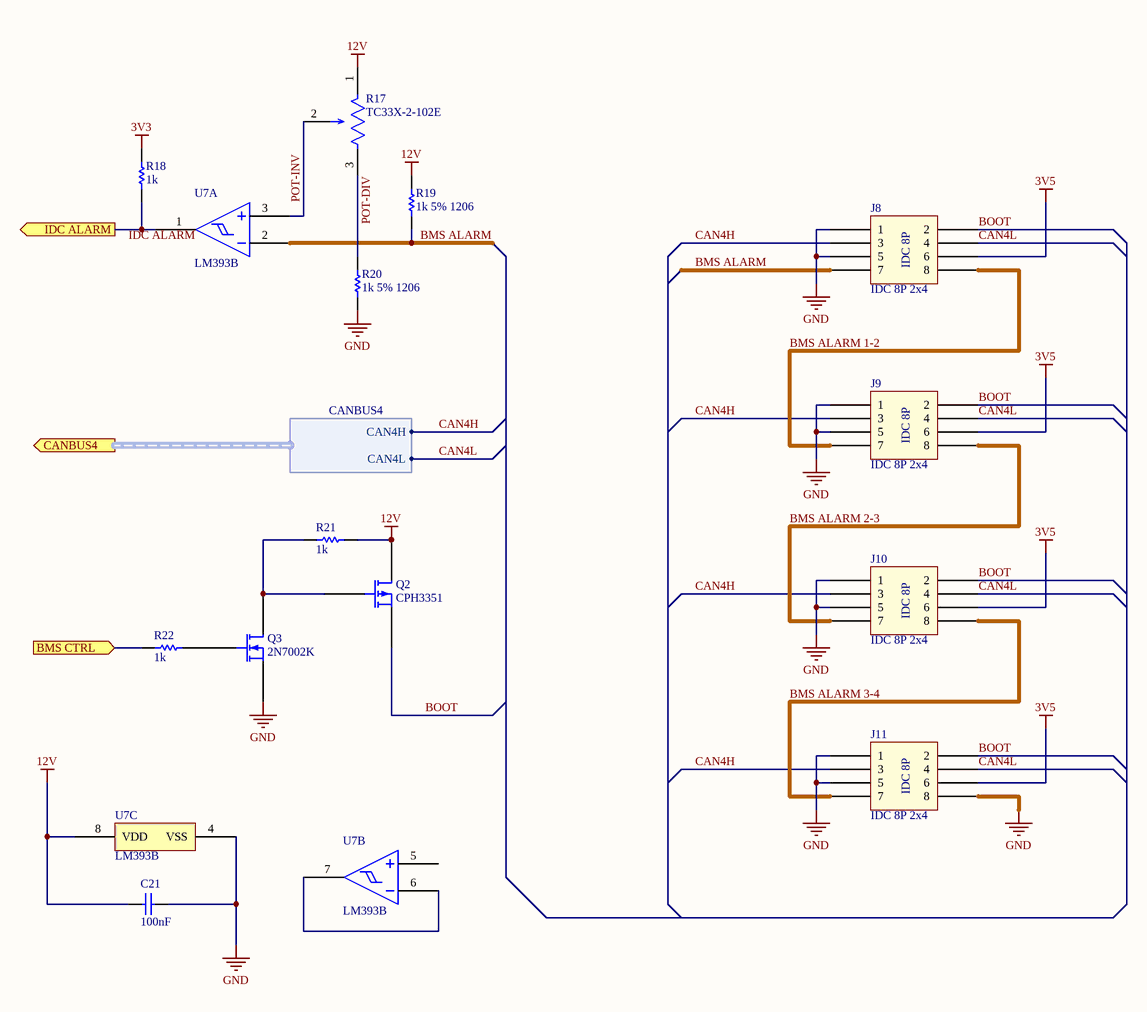
[diagram p6: AMU-S08-V00-IDCloops.SchDoc]

### Parts
C21  100nF  [Cap_Ceramic_0603]
J8  IDC 8P 2x4  [IDC 2.54MM 8P]
J9  IDC 8P 2x4  [IDC 2.54MM 8P]
J10  IDC 8P 2x4  [IDC 2.54MM 8P]
J11  IDC 8P 2x4  [IDC 2.54MM 8P]
Q2  CPH3351  [SOT-23-3]
Q3  2N7002K  [SOT-23-3]
R17  TC33X-2-102E  [TC33]
R18  1k  [Res_ThinFilm_0603]
R19  1k 5% 1206  [Res_ThinFilm_1206]
R20  1k 5% 1206  [Res_ThinFilm_1206]
R21  1k  [Res_ThinFilm_0603]
R22  1k  [Res_ThinFilm_1206]
U7  LM393B  [SOIC-8]  (parts A,B,C of 3)

### Ports
BMS CTRL (in), CANBUS4 (out, harness CANBUS4), IDC ALARM (out)

### Harnesses
CANBUS4: CAN4H, CAN4L

### Nets
3V3: R18.2
3V5: J8.6 J9.6 J10.6 J11.6
12V: C21.1 Q2.D R17.1 R19.2 R21.2 U7.8(VDD)
GND: C21.2 J8.1 J8.5 J9.1 J9.5 J10.1 J10.5 J11.1 J11.5 J11.8 Q3.S R20.1 U7.4(VSS)
BMS ALARM: J8.7 R19.1 U7.2(IN1-)
BMS ALARM 1-2: J8.8 J9.7
BMS ALARM 2-3: J9.8 J10.7
BMS ALARM 3-4: J10.8 J11.7
BMS CTRL: R22.1 ; port BMS CTRL
BOOT: J8.2 J9.2 J10.2 J11.2 Q2.S
CAN4H: J8.3 J9.3 J10.3 J11.3 ; port CANBUS4.CAN4H
CAN4L: J8.4 J9.4 J10.4 J11.4 ; port CANBUS4.CAN4L
IDC ALARM: R18.1 U7.1(OUT1) ; port IDC ALARM
POT-DIV: R17.3 R20.2
POT-INV: R17.2 U7.3(IN1+)
NetQ2_G: Q2.G Q3.D R21.1
NetQ3_G: Q3.G R22.2
NetU7_6: U7.6(IN2-) U7.7(OUT1)

Not connected (* = marked no-connect by the designer): U7 5(IN2+)

### Notes on the sheet
- Labels drawn without touching a wire or pin: IDC ALARM
- Revision History:
- Sheet Title:
- Rev
- Date
- Description
- Project:
- Size:
- Drawn By:
- A3
- Number:
- Revision:
- Sheet
- Version:
- of
- QUT Motorsport
- O-120, Gardens Point
- 2 George Street
- Brisbane, QLD 4000
- Australia
- Print Date:
- Print Time:
- File Name:
- (in symbol IDC 8P 2x4) IDC 8P

### Library data of the parts
C21 = 100nF 50V 5% X7R 0603: as C1 on sheet AMU-S02-V00-PSU3V3
Q2 = CPH3351: P-Channel 60V 1.8A (Ta) 1W (Ta) Surface Mount 3-CPH; ComponentLink1Description: Datasheet; ComponentLink1URL: https://www.onsemi.com/pub/Collateral/CPH3351-D.PDF; ComponentLink2Description: Digikey; ComponentLink2URL: https://www.digikey.com/products/en/discrete-semiconductor-products/transistors-fets-mosfets-single/278?k=&pkeyword=&sv=0&pv7=2&sf=0&FV=-1%7C488%2C-8%7C278&mpart=CPH3351-TL-W&quantity=&ColumnSort=0&page=1&stock=1&nstock=1&datasheet=1&photo=1&pageSize=25
Q3 = 2N7002K: N-Channel 60V 300mA (Ta) 350mW (Ta) Surface Mount SOT-23 (TO-236AB)
R17 = TC33X-2-102E: 1 kOhms 0.1W, 1/10W J Lead Surface Mount Trimmer Potentiometer Cermet 1 Turn Top Adjustment
R18 R21 = 1k 5% 0603: Resistor, SMD, 1k, 0.1W, 5%, 0603
R19 R20 R22 = 1k 5% 1206: 1 kOhms ±5% 0.25W, 1/4W Chip Resistor 1206 (3216 Metric) Moisture Resistant Thick Film; ComponentLink1Description: Datasheet; ComponentLink1URL: https://www.yageo.com/upload/media/product/productsearch/datasheet/rchip/PYu-RC_Group_51_RoHS_L_10.pdf
U7 = LM393B: Comparator General Purpose Open-Collector 8-SOIC

## Sheet AMU-S07-V00-Alarm.SchDoc: Alarm Relay
size A3; DrawnBy: Thomas Benedetti; DocumentNumber: 7; SheetNumber: 7; SheetTotal: 12; Version: 00; Project: AMU 2020; PageSetup: Record=PageOptions|CenterHorizontal=True|CenterVertical=True|PrintScale=0.97|XCorrection=1.00|YCorrection=1.00|PrintKind=0|BorderSize=5000000|LeftOffset=0|BottomOffset=0|Orientation=2|PaperLength=1000|PaperWidth=1000|Scale=100|PaperSource=7|PrintQuality=-4|MediaType=1|DitherType=10|PaperKind=A4|PrintScaleMode=1
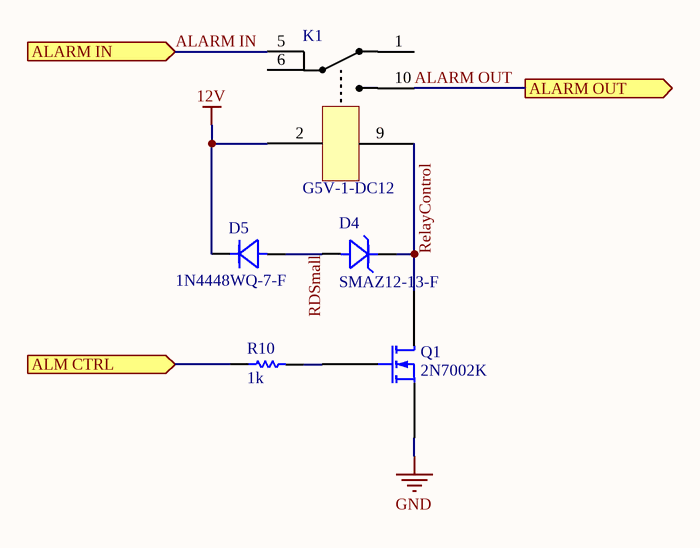
[diagram p7: AMU-S07-V00-Alarm.SchDoc]

### Parts
D4  SMAZ12-13-F  [SMA]
D5  1N4448WQ-7-F  [SMA]
K1  G5V-1-DC12  [G5V-1]
Q1  2N7002K  [SOT-23-3]
R10  1k  [Res_ThinFilm_0603]

### Ports
ALARM IN (in), ALARM OUT (out), ALM CTRL (in)

### Nets
12V: D5.K(Cathode) K1.2
GND: Q1.S
ALARM IN: K1.5 ; port ALARM IN
ALARM OUT: K1.10 ; port ALARM OUT
ALM CTRL: R10.1 ; port ALM CTRL
RDSmall: D4.A(Anode) D5.A(Anode)
RelayControl: D4.K(Cathode) K1.9 Q1.D
NetQ1_G: Q1.G R10.2

Not connected (* = marked no-connect by the designer): K1 1 6

### Notes on the sheet
- Revision History:
- Sheet Title:
- Rev
- Date
- Description
- Project:
- Size:
- Drawn By:
- A3
- Number:
- Revision:
- Sheet
- Version:
- of
- QUT Motorsport
- O-120, Gardens Point
- 2 George Street
- Brisbane, QLD 4000
- Australia
- Print Date:
- Print Time:
- File Name:

### Library data of the parts
D4 = SMAZ12-13-F: as D8 on sheet AMU-S11-V00-ContactorInterface; ComponentLink1Description: Digikey; ComponentLink1URL: https://www.digikey.com.au/product-detail/en/diodes-incorporated/SMAZ12-13-F/SMAZ12-FDICT-ND/725073; ComponentLink2Description: Datasheet; ComponentLink2URL: https://www.diodes.com/assets/Datasheets/ds18015.pdf
D5 = 1N4448WQ-7-F: as D9 on sheet AMU-S11-V00-ContactorInterface; Parameter 1: *; Weight: 0.0276g; Category: Rectifier Diodes; Contact Plating: Tin,Matte; Forward Current: 150mA; Lead Free: Lead Free; Max Operating Temperature: 150°C; Max Repetitive Reverse Voltage (Vrrm): 75V; Max Reverse Voltage (DC): 75V; Min Operating Temperature: -55°C; Mount: Surface Mount; Number of Pins: 2; Package Quantity: 1; Packaging: Tape and Reel; Peak Reverse Current: 5uA; Radiation Hardening: No; REACH SVHC: No SVHC; Reverse Recovery Time: 4ns; Height: 1mm; Length: 1.8mm; Reverse Voltage: 75V; Width: 1.35mm
K1 = G5V-1-DC12: General Purpose Relay SPDT (1 Form C) Through Hole, 12V, 2A
Q1 = 2N7002K: as Q3 on sheet AMU-S08-V00-IDCloops
R10 = 1k 5% 0603: Resistor, SMD, 1k, 0.1W, 5%, 0603

## Sheet AMU-S09-V00-Microfit.SchDoc: CANBUS Micro-Fit
size A3; DrawnBy: Thomas Benedetti; DocumentNumber: 9; SheetNumber: 9; SheetTotal: 12; Version: 00; Project: AMU 2020; PageSetup: Record=PageOptions|CenterHorizontal=True|CenterVertical=True|PrintScale=0.97|XCorrection=1.00|YCorrection=1.00|PrintKind=0|BorderSize=5000000|LeftOffset=0|BottomOffset=0|Orientation=2|PaperLength=1000|PaperWidth=1000|Scale=100|PaperSource=7|PrintQuality=-4|MediaType=1|DitherType=10|PaperKind=A4|PrintScaleMode=1
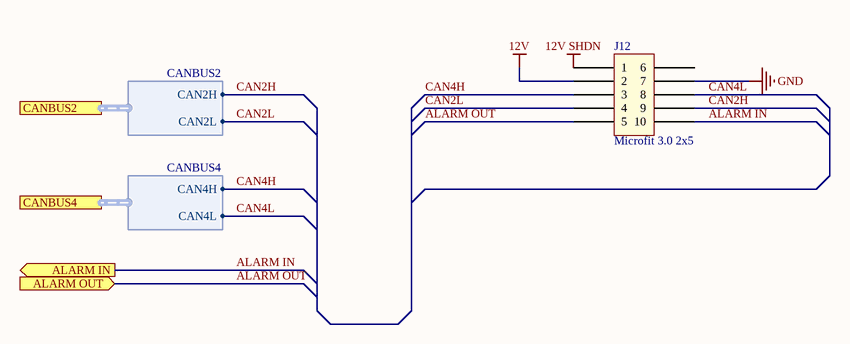
[diagram p8: AMU-S09-V00-Microfit.SchDoc]

### Parts
J12  Microfit 3.0 2x5  [Microfit_2X5_R_TH]

### Ports
ALARM IN (out), ALARM OUT (in), CANBUS2 (harness CANBUS2), CANBUS4 (harness CANBUS4)

### Harnesses
CANBUS2: CAN2H, CAN2L
CANBUS4: CAN4H, CAN4L

### Nets
12V: J12.2
12V SHDN: J12.1
GND: J12.7
ALARM IN: J12.10 ; port ALARM IN
ALARM OUT: J12.5 ; port ALARM OUT
CAN2H: J12.9 ; port CANBUS2.CAN2H
CAN2L: J12.4 ; port CANBUS2.CAN2L
CAN4H: J12.3 ; port CANBUS4.CAN4H
CAN4L: J12.8 ; port CANBUS4.CAN4L

Not connected (* = marked no-connect by the designer): J12 6

### Notes on the sheet
- Revision History:
- Sheet Title:
- Rev
- Date
- Description
- Project:
- Size:
- Drawn By:
- A3
- Number:
- Revision:
- Sheet
- Version:
- of
- QUT Motorsport
- O-120, Gardens Point
- 2 George Street
- Brisbane, QLD 4000
- Australia
- Print Date:
- Print Time:
- File Name:

### Library data of the parts
J12 = Microfit_2x5

## Sheet AMU-S10-V00-Buzzer.SchDoc: Shutdown Buzzer
size A3; DrawnBy: Jonn Dillon; DocumentNumber: 10; SheetNumber: 10; SheetTotal: 12
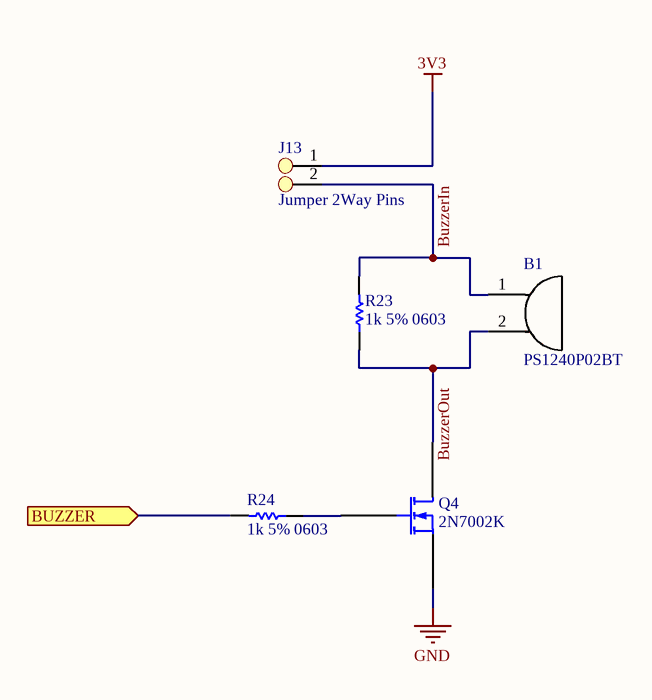
[diagram p9: AMU-S10-V00-Buzzer.SchDoc]

### Parts
B1  PS1240P02BT  [PS1240P02BT]
J13  Jumper 2Way Pins  [Jumper_2Way_Pin]
Q4  2N7002K  [SOT-23-3]
R23  1k 5% 0603  [Res_ThinFilm_0603]
R24  1k 5% 0603  [Res_ThinFilm_0603]

### Ports
BUZZER (in)

### Nets
3V3: J13.1
GND: Q4.S
BUZZER: R24.2 ; port BUZZER
BuzzerIn: B1.1 J13.2 R23.2
BuzzerOut: B1.2 Q4.D R23.1
NetQ4_G: Q4.G R24.1

### Notes on the sheet
- Revision History:
- Sheet Title:
- Rev
- Date
- Description
- Project:
- Size:
- Drawn By:
- A3
- Number:
- Revision:
- Sheet
- Version:
- of
- QUT Motorsport
- O-120, Gardens Point
- 2 George Street
- Brisbane, QLD 4000
- Australia
- Print Date:
- Print Time:
- File Name:

### Library data of the parts
B1 = PS1240P02BT: Buzzers Transducer, Externally Driven Piezo 3V 4kHz 60dB @ 3V, 10cm Through Hole PC Pins
J13 = Jumper 2Way Side Pins
Q4 = 2N7002K: as Q3 on sheet AMU-S08-V00-IDCloops
R23 R24 = 1k 5% 0603: Resistor, SMD, 1k, 0.1W, 5%, 0603

## Sheet AMU-S05-V00-CAN2.SchDoc: Isolated CANBUS2 3V3
size A3; DrawnBy: Jonn Dillon; DocumentNumber: 5; Revision: 01; SheetNumber: 5; SheetTotal: 12; Version: 01; Project: AMU 2020 (Sourced from BMS 2020); PageSetup: Record=PageOptions|CenterHorizontal=True|CenterVertical=True|PrintScale=0.97|XCorrection=1.00|YCorrection=1.00|PrintKind=0|BorderSize=5000000|LeftOffset=0|BottomOffset=0|Orientation=2|PaperLength=1000|PaperWidth=1000|Scale=100|PaperSource=7|PrintQuality=-4|MediaType=1|DitherType=10|PaperKind=A4|PrintScaleMode=1
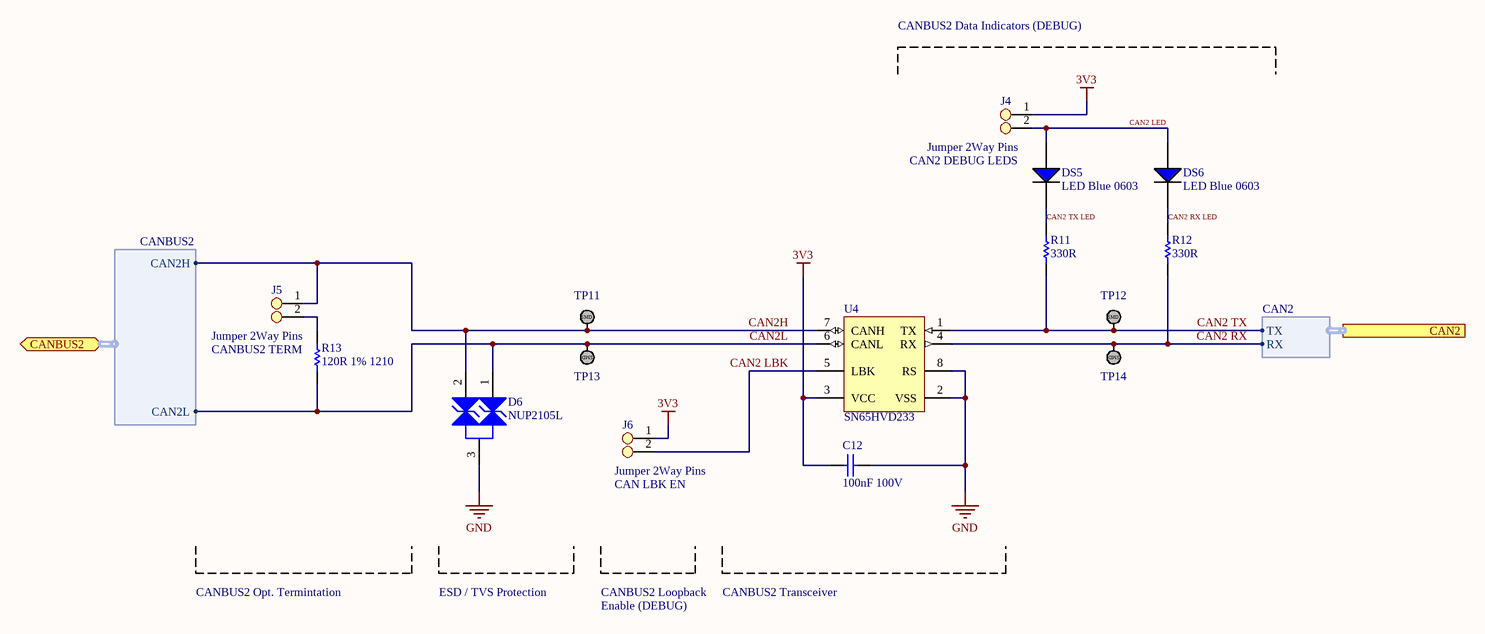
[diagram p10: AMU-S05-V00-CAN2.SchDoc]

### Parts
C12  100nF 100V  [Cap_Ceramic_0603]
D6  NUP2105L  [NUP2105L]
DS5  LED Blue 0603  [LED BLUE 0603]
DS6  LED Blue 0603  [LED BLUE 0603]
J4  Jumper 2Way Pins  [Jumper_2Way_Pin]
J5  Jumper 2Way Pins  [Jumper_2Way_Pin]
J6  Jumper 2Way Pins  [Jumper_2Way_Pin]
R11  330R  [Res_ThinFilm_0603]
R12  330R  [Res_ThinFilm_0603]
R13  120R 1% 1210  [Res_ThinFilm_1210]
TP11  TestPoint_SMD  [TestPointSMD]  (value not drawn)
TP12  TestPoint_SMD  [TestPointSMD]  (value not drawn)
TP13  TestPoint_SMD  [TestPointSMD]  (value not drawn)
TP14  TestPoint_SMD  [TestPointSMD]  (value not drawn)
U4  SN65HVD233  [SN65HVD233DR]

### Ports
CAN2 (harness CAN2), CANBUS2 (bidir, harness CANBUS2)

### Harnesses
CANBUS2: CAN2H, CAN2L
CAN2: RX, TX

### Nets
3V3: C12.2 J4.1 J6.1 U4.3(VCC)
GND: C12.1 D6.3 U4.2(VSS) U4.8(RS)
CAN2 LBK: J6.2 U4.5(LBK)
CAN2 LED: DS5.1(A) DS6.1(A) J4.2
CAN2 RX: R12.1 TP14.1 U4.4(RX) ; port CAN2.RX
CAN2 RX LED: DS6.2(C) R12.2
CAN2 TX: R11.1 TP12.1 U4.1(TX) ; port CAN2.TX
CAN2 TX LED: DS5.2(C) R11.2
CAN2H: D6.2 J5.1 TP11.1 U4.7(CANH) ; port CANBUS2.CAN2H
CAN2L: D6.1 R13.1 TP13.1 U4.6(CANL) ; port CANBUS2.CAN2L
NetJ5_2: J5.2 R13.2

### Notes on the sheet
- CANBUS2 Data Indicators (DEBUG)
- CAN2 DEBUG LEDS
- (near R13) CANBUS2 TERM
- (near J6) CAN LBK EN
- CANBUS2 Opt. Termintation
- ESD / TVS Protection
- CANBUS2 Loopback
- Enable (DEBUG)
- CANBUS2 Transceiver
- Revision History:
- Sheet Title:
- Rev
- Date
- Description
- Project:
- Size:
- Drawn By:
- A3
- Number:
- Revision:
- Sheet
- Version:
- of
- QUT Motorsport
- O-120, Gardens Point
- 2 George Street
- Brisbane, QLD 4000
- Australia
- Print Date:
- Print Time:
- File Name:
- (in symbol TestPoint_SMD) SMD

### Library data of the parts
C12 = 100nF 100V 5% X7R 0603: as C6 on sheet AMU-S03-V00-PSU3V5
J4-J6 = Jumper 2Way Side Pins
R11 R12 = 330R 5% 0603: Resistor, SMD, 330R, 0.1W, 5%, 0603
R13 = 120R 1% 1210: Resistor, SMD, 120R, 0.25W, 1%, 1210
D6 = NUP2105L: ComponentLink1Description: Datasheet; ComponentLink1URL: https://www.onsemi.cn/PowerSolutions/document/NUP2105L-D.PDF; Parameter 1: *; ComponentLink2Description: LCSC; ComponentLink2URL: https://lcsc.com/product-detail/TVS_ON-Semiconductor-NUP2105LT1G_C14486.html; ComponentLink3Description: Digikey; ComponentLink3URL: https://www.digikey.com.au/product-detail/en/on-semiconductor/SZNUP2105LT1G/SZNUP2105LT1GOSCT-ND/3487669
U4 = SN65HVD233: ComponentLink1Description: LCSC; ComponentLink1URL: https://lcsc.com/product-detail/CAN-ICs_Texas-Instruments_SN65HVD233DRG4_Texas-Instruments-Texas-Instruments-SN65HVD233DRG4_C61643.html; ComponentLink2Description: Digikey; ComponentLink2URL: https://www.digikey.com.au/product-detail/en/texas-instruments/SN65HVD233DR/296-35967-1-ND/4134960; ComponentLink3Description: Datasheet; ComponentLink3URL: https://www.ti.com/lit/ds/symlink/sn65hvd233.pdf?ts=1588560888178; ComponentLink4Description: Ti Product Page; ComponentLink4URL: https://www.ti.com/product/SN65HVD233

## Sheet AMU-S06-V00-CAN4.SchDoc: Isolated CANBUS4 3V3
size A3; DrawnBy: Jonn Dillon; DocumentNumber: 6; Revision: 01; SheetNumber: 6; SheetTotal: 12; Version: 01; Project: AMU 2020 (Sourced from BMS 2020); PageSetup: Record=PageOptions|CenterHorizontal=True|CenterVertical=True|PrintScale=0.97|XCorrection=1.00|YCorrection=1.00|PrintKind=0|BorderSize=5000000|LeftOffset=0|BottomOffset=0|Orientation=2|PaperLength=1000|PaperWidth=1000|Scale=100|PaperSource=7|PrintQuality=-4|MediaType=1|DitherType=10|PaperKind=A4|PrintScaleMode=1
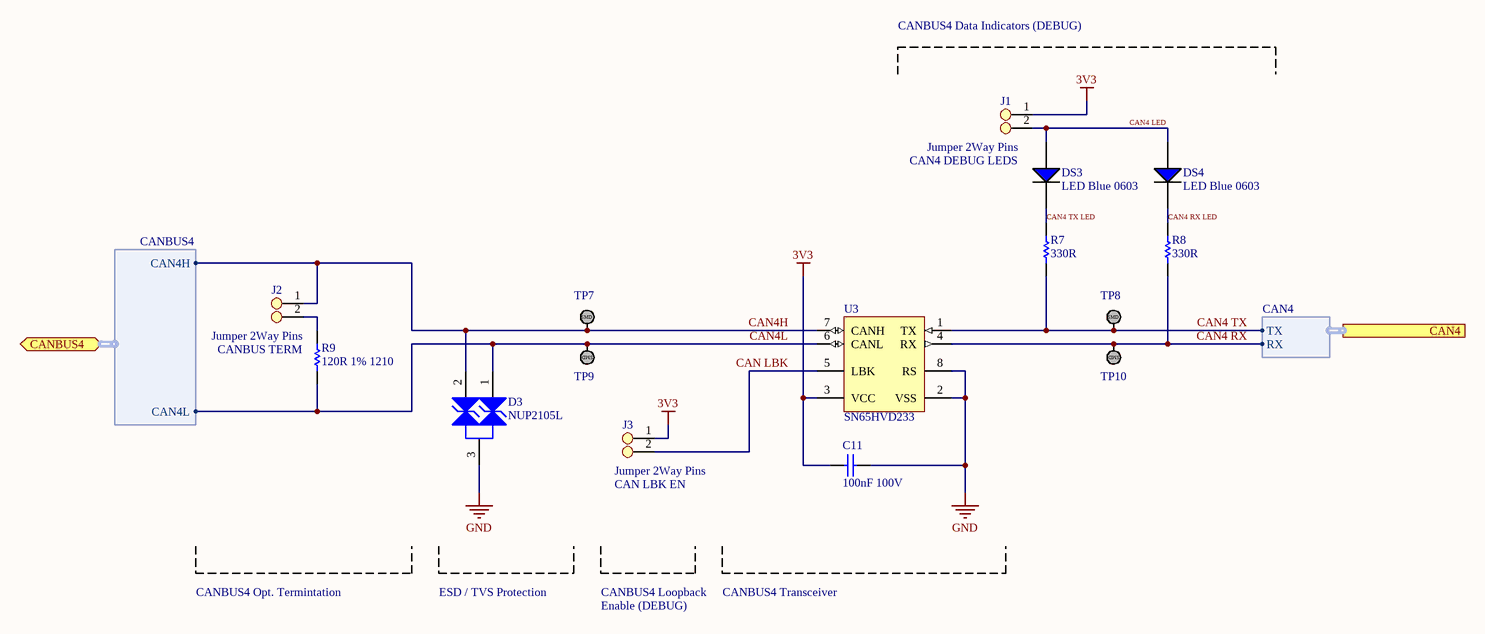
[diagram p11: AMU-S06-V00-CAN4.SchDoc]

### Parts
C11  100nF 100V  [Cap_Ceramic_0603]
D3  NUP2105L  [NUP2105L]
DS3  LED Blue 0603  [LED BLUE 0603]
DS4  LED Blue 0603  [LED BLUE 0603]
J1  Jumper 2Way Pins  [Jumper_2Way_Pin]
J2  Jumper 2Way Pins  [Jumper_2Way_Pin]
J3  Jumper 2Way Pins  [Jumper_2Way_Pin]
R7  330R  [Res_ThinFilm_0603]
R8  330R  [Res_ThinFilm_0603]
R9  120R 1% 1210  [Res_ThinFilm_1210]
TP7  TestPoint_SMD  [TestPointSMD]  (value not drawn)
TP8  TestPoint_SMD  [TestPointSMD]  (value not drawn)
TP9  TestPoint_SMD  [TestPointSMD]  (value not drawn)
TP10  TestPoint_SMD  [TestPointSMD]  (value not drawn)
U3  SN65HVD233  [SN65HVD233DR]

### Ports
CAN4 (harness CAN4), CANBUS4 (bidir, harness CANBUS4)

### Harnesses
CANBUS4: CAN4H, CAN4L
CAN4: RX, TX

### Nets
3V3: C11.2 J1.1 J3.1 U3.3(VCC)
GND: C11.1 D3.3 U3.2(VSS) U3.8(RS)
CAN4 LED: DS3.1(A) DS4.1(A) J1.2
CAN4 RX: R8.1 TP10.1 U3.4(RX) ; port CAN4.RX
CAN4 RX LED: DS4.2(C) R8.2
CAN4 TX: R7.1 TP8.1 U3.1(TX) ; port CAN4.TX
CAN4 TX LED: DS3.2(C) R7.2
CAN4H: D3.2 J2.1 TP7.1 U3.7(CANH) ; port CANBUS4.CAN4H
CAN4L: D3.1 R9.1 TP9.1 U3.6(CANL) ; port CANBUS4.CAN4L
CAN LBK: J3.2 U3.5(LBK)
NetJ2_2: J2.2 R9.2

### Notes on the sheet
- CANBUS4 Data Indicators (DEBUG)
- CAN4 DEBUG LEDS
- (near R9) CANBUS TERM
- (near J3) CAN LBK EN
- CANBUS4 Opt. Termintation
- ESD / TVS Protection
- CANBUS4 Loopback
- Enable (DEBUG)
- CANBUS4 Transceiver
- Revision History:
- Sheet Title:
- Rev
- Date
- Description
- Project:
- Size:
- Drawn By:
- A3
- Number:
- Revision:
- Sheet
- Version:
- of
- QUT Motorsport
- O-120, Gardens Point
- 2 George Street
- Brisbane, QLD 4000
- Australia
- Print Date:
- Print Time:
- File Name:
- (in symbol TestPoint_SMD) SMD

### Library data of the parts
C11 = 100nF 100V 5% X7R 0603: as C6 on sheet AMU-S03-V00-PSU3V5
J1-J3 = Jumper 2Way Side Pins
R7 R8 = 330R 5% 0603: Resistor, SMD, 330R, 0.1W, 5%, 0603
R9 = 120R 1% 1210: Resistor, SMD, 120R, 0.25W, 1%, 1210
D3 = NUP2105L: ComponentLink1Description: Datasheet; ComponentLink1URL: https://www.onsemi.cn/PowerSolutions/document/NUP2105L-D.PDF; Parameter 1: *; ComponentLink2Description: LCSC; ComponentLink2URL: https://lcsc.com/product-detail/TVS_ON-Semiconductor-NUP2105LT1G_C14486.html; ComponentLink3Description: Digikey; ComponentLink3URL: https://www.digikey.com.au/product-detail/en/on-semiconductor/SZNUP2105LT1G/SZNUP2105LT1GOSCT-ND/3487669
U3 = SN65HVD233: ComponentLink1Description: LCSC; ComponentLink1URL: https://lcsc.com/product-detail/CAN-ICs_Texas-Instruments_SN65HVD233DRG4_Texas-Instruments-Texas-Instruments-SN65HVD233DRG4_C61643.html; ComponentLink2Description: Digikey; ComponentLink2URL: https://www.digikey.com.au/product-detail/en/texas-instruments/SN65HVD233DR/296-35967-1-ND/4134960; ComponentLink3Description: Datasheet; ComponentLink3URL: https://www.ti.com/lit/ds/symlink/sn65hvd233.pdf?ts=1588560888178; ComponentLink4Description: Ti Product Page; ComponentLink4URL: https://www.ti.com/product/SN65HVD233

## Nets that join several sheets
3V3: AMU-S02-V00-PSU3V3 (6 pins), AMU-S04-V00-Microcontroller (20 pins), AMU-S08-V00-IDCloops (R18.2), AMU-S10-V00-Buzzer (J13.1), AMU-S05-V00-CAN2 (C12.2 J4.1 J6.1 U4.3), AMU-S06-V00-CAN4 (C11.2 J1.1 J3.1 U3.3)
3V5: AMU-S03-V00-PSU3V5 (6 pins), AMU-S08-V00-IDCloops (J8.6 J9.6 J10.6 J11.6)
12V: AMU-S02-V00-PSU3V3 (C2.2 C3.2 U1.4 U1.5), AMU-S03-V00-PSU3V5 (C7.2 C8.2 U2.4 U2.5), AMU-S11-V00-ContactorInterface (K2.2), AMU-S08-V00-IDCloops (6 pins), AMU-S07-V00-Alarm (D5.K K1.2), AMU-S09-V00-Microfit (J12.2)
12V SHDN: AMU-S11-V00-ContactorInterface (6 pins), AMU-S09-V00-Microfit (J12.1)
GND: AMU-S02-V00-PSU3V3 (8 pins), AMU-S03-V00-PSU3V5 (8 pins), AMU-S11-V00-ContactorInterface (7 pins), U_AMU-S11-V00-ContactorInterface/PROFET 3 (7 pins), U_AMU-S11-V00-ContactorInterface/PROFET 2 (7 pins), U_AMU-S11-V00-ContactorInterface/PROFET 1 (7 pins), AMU-S04-V00-Microcontroller (25 pins), AMU-S08-V00-IDCloops (13 pins), AMU-S07-V00-Alarm (Q1.S), AMU-S09-V00-Microfit (J12.7), AMU-S10-V00-Buzzer (Q4.S), AMU-S05-V00-CAN2 (C12.1 D6.3 U4.2 U4.8), AMU-S06-V00-CAN4 (C11.1 D3.3 U3.2 U3.8)
ALARM IN: AMU-S07-V00-Alarm (K1.5), AMU-S09-V00-Microfit (J12.10)
ALARM OUT: AMU-S07-V00-Alarm (K1.10), AMU-S09-V00-Microfit (J12.5)
ALM CTRL: AMU-S04-V00-Microcontroller (U5.28), AMU-S07-V00-Alarm (R10.1)
BMS CTRL: AMU-S04-V00-Microcontroller (U5.58), AMU-S08-V00-IDCloops (R22.1)
BUZZER: AMU-S04-V00-Microcontroller (U5.59), AMU-S10-V00-Buzzer (R24.2)
CAN2 RX: AMU-S04-V00-Microcontroller (U5.33), AMU-S05-V00-CAN2 (R12.1 TP14.1 U4.4)
CAN2 TX: AMU-S04-V00-Microcontroller (U5.34), AMU-S05-V00-CAN2 (R11.1 TP12.1 U4.1)
CAN2H: AMU-S09-V00-Microfit (J12.9), AMU-S05-V00-CAN2 (D6.2 J5.1 TP11.1 U4.7)
CAN2L: AMU-S09-V00-Microfit (J12.4), AMU-S05-V00-CAN2 (D6.1 R13.1 TP13.1 U4.6)
CAN4 RX: AMU-S04-V00-Microcontroller (U5.44), AMU-S06-V00-CAN4 (R8.1 TP10.1 U3.4)
CAN4 TX: AMU-S04-V00-Microcontroller (U5.45), AMU-S06-V00-CAN4 (R7.1 TP8.1 U3.1)
CAN4H: AMU-S08-V00-IDCloops (J8.3 J9.3 J10.3 J11.3), AMU-S09-V00-Microfit (J12.3), AMU-S06-V00-CAN4 (D3.2 J2.1 TP7.1 U3.7)
CAN4L: AMU-S08-V00-IDCloops (J8.4 J9.4 J10.4 J11.4), AMU-S09-V00-Microfit (J12.8), AMU-S06-V00-CAN4 (D3.1 R9.1 TP9.1 U3.6)
FAN: AMU-S11-V00-ContactorInterface (J14.5), U_AMU-S11-V00-ContactorInterface/PROFET 3 (C25A.1 Q5A.9)
HVA+: AMU-S11-V00-ContactorInterface (J14.3), U_AMU-S11-V00-ContactorInterface/PROFET 1 (C26C.1 Q5C.13)
HVA-: AMU-S11-V00-ContactorInterface (J14.6), U_AMU-S11-V00-ContactorInterface/PROFET 2 (C26B.1 Q5B.13)
HVB+: AMU-S11-V00-ContactorInterface (J14.2), U_AMU-S11-V00-ContactorInterface/PROFET 1 (C25C.1 Q5C.9)
HVB-: AMU-S11-V00-ContactorInterface (J14.7), U_AMU-S11-V00-ContactorInterface/PROFET 2 (C25B.1 Q5B.9)
IDC ALARM: AMU-S04-V00-Microcontroller (U5.57), AMU-S08-V00-IDCloops (R18.1 U7.1)
OUT0: AMU-S11-V00-ContactorInterface (J14.1), U_AMU-S11-V00-ContactorInterface/PROFET 3 (C26A.1 Q5A.13)
PFET1 ADC: U_AMU-S11-V00-ContactorInterface/PROFET 1 (C24C.2 R29C.1), AMU-S04-V00-Microcontroller (U5.11)
PFET1 DEN: U_AMU-S11-V00-ContactorInterface/PROFET 1 (R27C.1), AMU-S04-V00-Microcontroller (U5.14)
PFET1 DSEL: U_AMU-S11-V00-ContactorInterface/PROFET 1 (R28C.1), AMU-S04-V00-Microcontroller (U5.10)
PFET1 IN0: U_AMU-S11-V00-ContactorInterface/PROFET 1 (R25C.1), AMU-S04-V00-Microcontroller (U5.15)
PFET1 IN1: U_AMU-S11-V00-ContactorInterface/PROFET 1 (R26C.1), AMU-S04-V00-Microcontroller (U5.9)
PFET2 ADC: U_AMU-S11-V00-ContactorInterface/PROFET 2 (C24B.2 R29B.1), AMU-S04-V00-Microcontroller (U5.20)
PFET2 DEN: U_AMU-S11-V00-ContactorInterface/PROFET 2 (R27B.1), AMU-S04-V00-Microcontroller (U5.21)
PFET2 DSEL: U_AMU-S11-V00-ContactorInterface/PROFET 2 (R28B.1), AMU-S04-V00-Microcontroller (U5.17)
PFET2 IN0: U_AMU-S11-V00-ContactorInterface/PROFET 2 (R25B.1), AMU-S04-V00-Microcontroller (U5.22)
PFET2 IN1: U_AMU-S11-V00-ContactorInterface/PROFET 2 (R26B.1), AMU-S04-V00-Microcontroller (U5.16)
PFET3 ADC: U_AMU-S11-V00-ContactorInterface/PROFET 3 (C24A.2 R29A.1), AMU-S04-V00-Microcontroller (U5.25)
PFET3 DEN: U_AMU-S11-V00-ContactorInterface/PROFET 3 (R27A.1), AMU-S04-V00-Microcontroller (U5.26)
PFET3 DSEL: U_AMU-S11-V00-ContactorInterface/PROFET 3 (R28A.1), AMU-S04-V00-Microcontroller (U5.24)
PFET3 IN0: U_AMU-S11-V00-ContactorInterface/PROFET 3 (R25A.1), AMU-S04-V00-Microcontroller (U5.27)
PFET3 IN1: U_AMU-S11-V00-ContactorInterface/PROFET 3 (R26A.1), AMU-S04-V00-Microcontroller (U5.23)
VS: AMU-S11-V00-ContactorInterface (K2.3), U_AMU-S11-V00-ContactorInterface/PROFET 3 (C22A.2 C23A.2 Q5A.15), U_AMU-S11-V00-ContactorInterface/PROFET 2 (C22B.2 C23B.2 Q5B.15), U_AMU-S11-V00-ContactorInterface/PROFET 1 (C22C.2 C23C.2 Q5C.15)